# EAGLE design GPS_radiologger_v5_b (EAGLE 9.5.2)
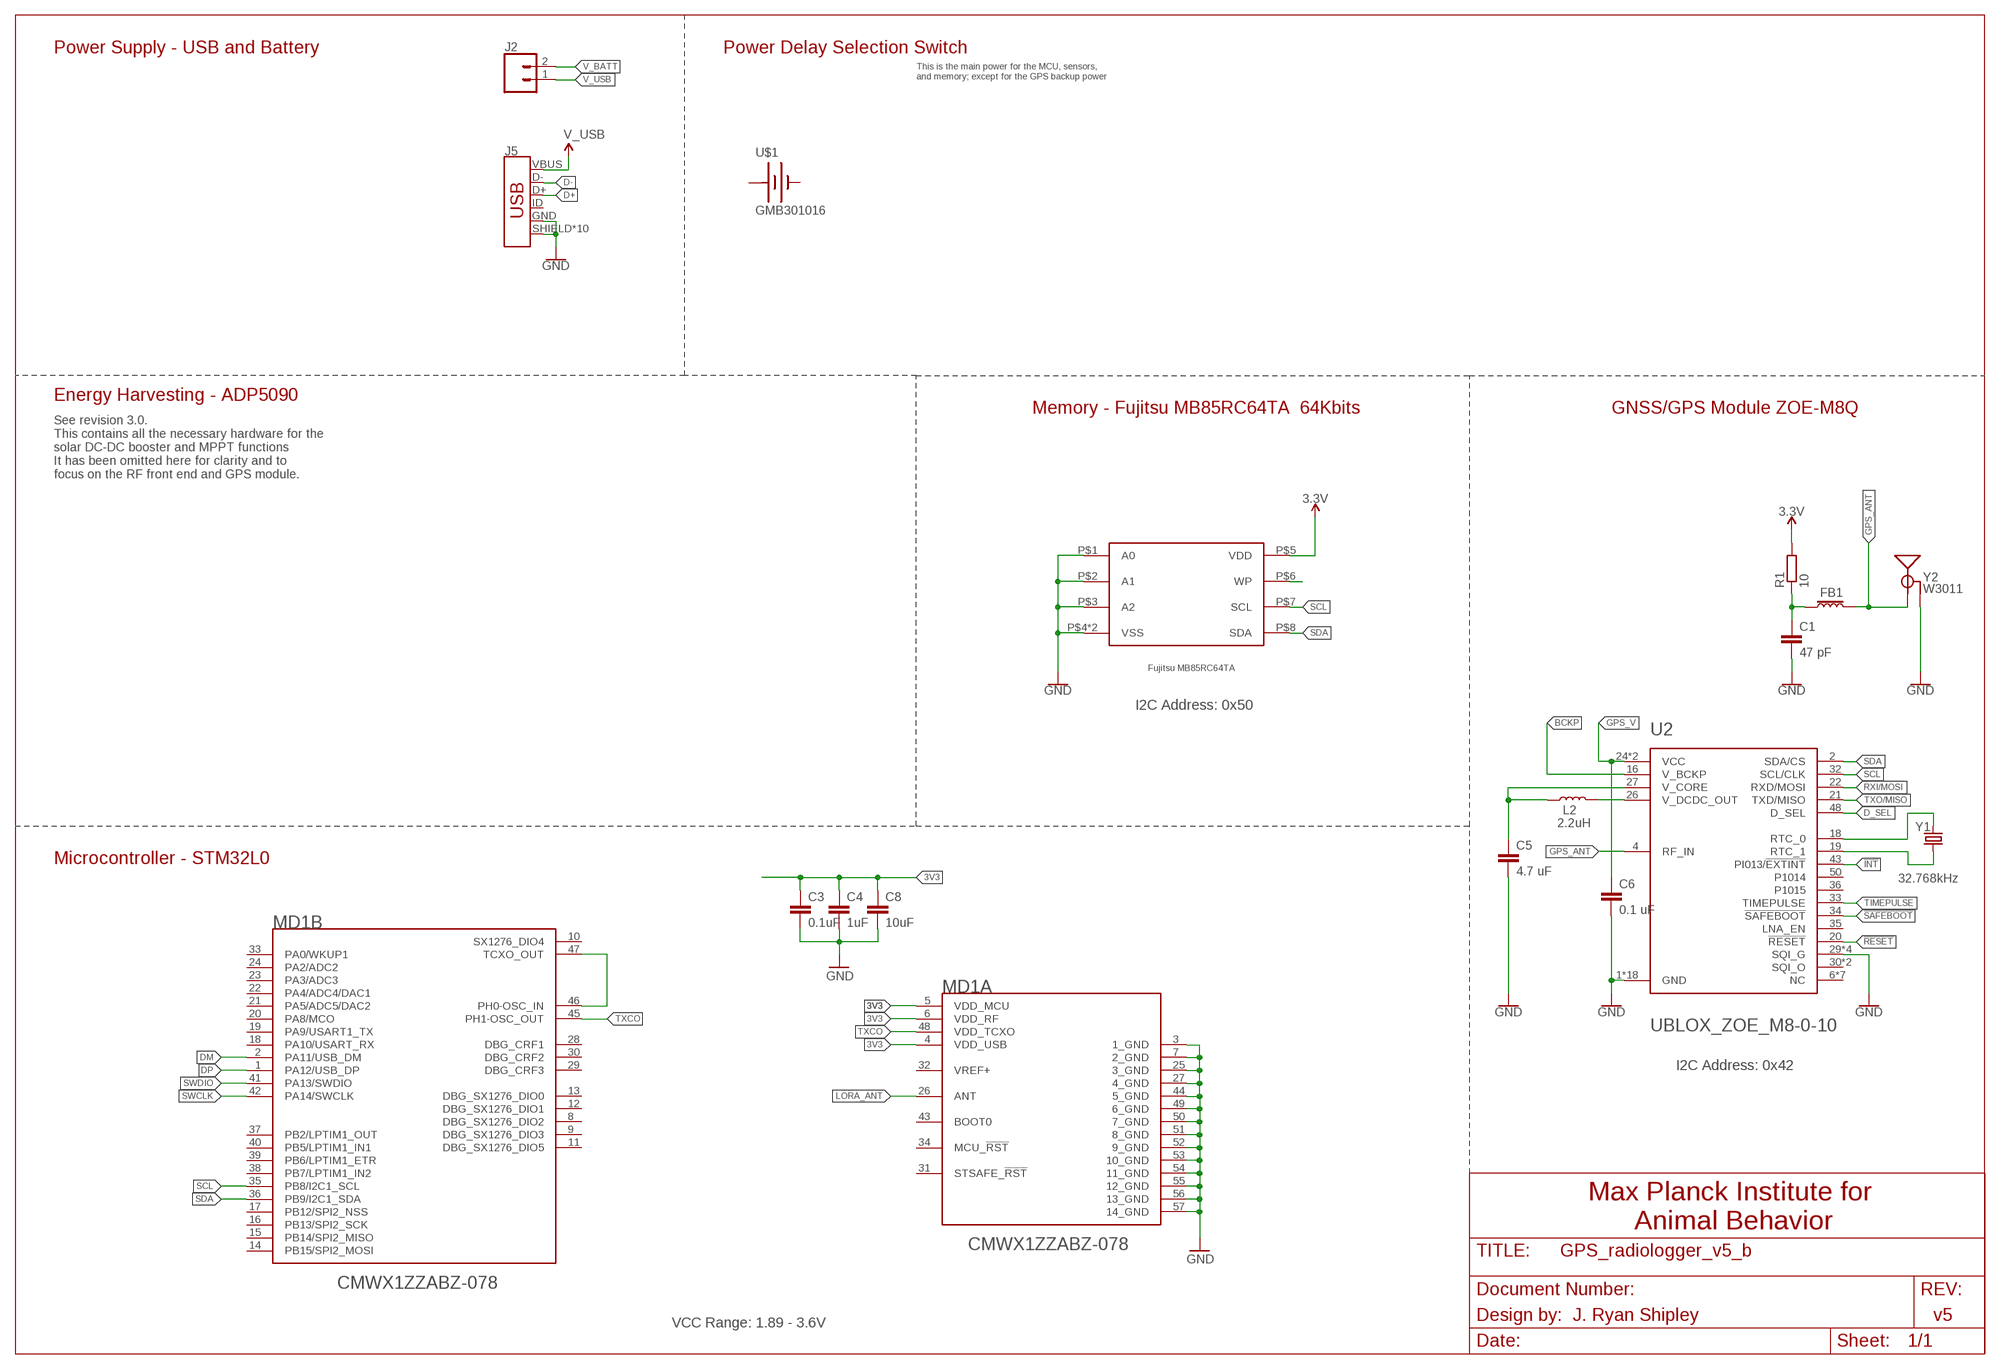
[diagram p0: schematic, sheet 1]

## Parts
C1  47 pF  C-EUC0201  [C0201]
C3  0.1uF  C-EUC0201  [C0201]
C4  1uF  C-EUC0201  [C0201]
C5  4.7 uF  C-EUC0201  [C0201]
C6  0.1 uF  C-EUC0201  [C0201]
C8  10uF  C-EUC0201  [C0201]
FB1  FERRITE_BEAD-120_OHM-0402  [0402]
J2  CONN_02  [1X02]
J5  USB_MICRO-B_HALF_PTH_MILL  [USB-MICROB-PTH-MILL]
L2  2.2uH  2.2μH_SHIELDED_INDUCTOR  [0806]
MD1  MURATA_CMWX1ZZABZ-078MURATA_CMWX1ZZABZ-078_0_0  [MURATA_CMWX1ZZABZ-078_0]
R1  10  R-EU_R0201  [R0201]
U2  UBLOX_ZOE_M8-0-10  [UBLOX_ZOE_M8-0-10]
U$1  GMB301016  [GMB301016]
U$2  MB85RC64TA  [8-SON_2X3]
Y1  32.768kHz  CRYSTAL-32.768KHZSMD-3.2X1.5  [CRYSTAL-SMD-3.2X1.5MM]
Y2  W3011  GPS_CHIP_ANTENNAW3011  [W3011]

## Nets
3.3V: R1.2 U$2.P$5(VDD)
3V3: C3.1 C4.1 C8.1 MD1.4(A:VDD_USB) MD1.5(A:VDD_MCU) MD1.6(A:VDD_RF)
!INT: U2.43(PI013/!EXTINT)
!RESET: U2.20(!RESET)
!SAFEBOOT: U2.34(!SAFEBOOT)
BCKP: U2.16(V_BCKP)
D+: J5.D+
D-: J5.D-
D_SEL: U2.48(D_SEL)
DM: MD1.2(B:PA11/USB_DM)
DP: MD1.1(B:PA12/USB_DP)
GND: C1.2 C3.2 C4.2 C5.2 C6.2 C8.2 J5.GND J5.SHIELD J5.SHIELD2(SHIELD) J5.SHIELD3(SHIELD) J5.SHIELD4(SHIELD) J5.SHIELD5(SHIELD) J5.SHIELD6(SHIELD) J5.SHIELD7(SHIELD) J5.SHIELD8(SHIELD) J5.SHIELD9(SHIELD) J5.SHIELD10(SHIELD) MD1.3(A:1_GND) MD1.7(A:2_GND) MD1.25(A:3_GND) MD1.27(A:4_GND) MD1.44(A:5_GND) MD1.49(A:6_GND) MD1.50(A:7_GND) MD1.51(A:8_GND) MD1.52(A:9_GND) MD1.53(A:10_GND) MD1.54(A:11_GND) MD1.55(A:12_GND) MD1.56(A:13_GND) MD1.57(A:14_GND) U2.1(GND) U2.3(GND) U2.5(GND) U2.7(GND) U2.8(GND) U2.9(GND) U2.10(GND) U2.11(GND) U2.12(GND) U2.17(GND) U2.23(GND) U2.29(SQI_G) U2.31(SQI_G) U2.37(GND) U2.38(GND) U2.39(GND) U2.40(GND) U2.41(GND) U2.44(GND) U2.46(SQI_G) U2.47(SQI_G) U2.49(GND) U$2.P$1(A0) U$2.P$2(A1) U$2.P$3(A2) U$2.P$4(VSS) U$2.P$9(VSS) Y2.2(GND) Y2.3(GND)
GPS_ANT: FB1.1 U2.4(RF_IN) Y2.1(SIGNAL)
GPS_V: C6.1 U2.24(VCC) U2.25(VCC)
LORA_ANT: MD1.26(A:ANT)
N$3: U$2.P$6(WP)
N$4: L2.2 U2.26(V_DCDC_OUT)
N$6: MD1.46(B:PH0-OSC_IN) MD1.47(B:TCXO_OUT)
N$9: C1.1 FB1.2 R1.1
N$13: C5.1 L2.1 U2.27(V_CORE)
N$14: U2.18(RTC_0) Y1.P$2
N$15: U2.19(RTC_1) Y1.P$1
RXI/MOSI: U2.22(RXD/MOSI)
SCL: MD1.35(B:PB8/I2C1_SCL) U2.32(SCL/CLK) U$2.P$7(SCL)
SDA: MD1.36(B:PB9/I2C1_SDA) U2.2(SDA/CS) U$2.P$8(SDA)
SWCLK: MD1.42(B:PA14/SWCLK)
SWDIO: MD1.41(B:PA13/SWDIO)
TIMEPULSE: U2.33(TIMEPULSE)
TXCO: MD1.45(B:PH1-OSC_OUT) MD1.48(A:VDD_TCXO)
TXO/MISO: U2.21(TXD/MISO)
V_BATT: J2.2
V_USB: J2.1 J5.VBUS
Unconnected: J5.ID MD1.8(B:DBG_SX1276_DIO2) MD1.9(B:DBG_SX1276_DIO3) MD1.10(B:SX1276_DIO4) MD1.11(B:DBG_SX1276_DIO5) MD1.12(B:DBG_SX1276_DIO1) MD1.13(B:DBG_SX1276_DIO0) MD1.14(B:PB15/SPI2_MOSI) MD1.15(B:PB14/SPI2_MISO) MD1.16(B:PB13/SPI2_SCK) MD1.17(B:PB12/SPI2_NSS) MD1.18(B:PA10/USART_RX) MD1.19(B:PA9/USART1_TX) MD1.20(B:PA8/MCO) MD1.21(B:PA5/ADC5/DAC2) MD1.22(B:PA4/ADC4/DAC1) MD1.23(B:PA3/ADC3) MD1.24(B:PA2/ADC2) MD1.28(B:DBG_CRF1) MD1.29(B:DBG_CRF3) MD1.30(B:DBG_CRF2) MD1.31(A:STSAFE_!RST!) MD1.33(B:PA0/WKUP1) MD1.34(A:MCU_!RST!) MD1.37(B:PB2/LPTIM1_OUT) MD1.38(B:PB7/LPTIM1_IN2) MD1.39(B:PB6/LPTIM1_ETR) MD1.40(B:PB5/LPTIM1_IN1) MD1.43(A:BOOT0) U2.6(NC) U2.13(NC) U2.14(NC) U2.15(NC) U2.28(NC) U2.30(SQI_O) U2.35(LNA_EN) U2.36(P1015) U2.42(NC) U2.45(SQI_O) U2.50(P1014) U2.51(NC)

## Notes on the sheet
- Power Supply - USB and Battery | Power Delay Selection Switch
- This is the main power for the MCU, sensors,
  and memory; except for the GPS backup power
- Energy Harvesting - ADP5090
- Memory - Fujitsu MB85RC64TA  64Kbits | GNSS/GPS Module ZOE-M8Q
- See revision 3.0.  
  This contains all the necessary hardware for the 
  solar DC-DC booster and MPPT functions
  It has been omitted here for clarity and to 
  focus on the RF front end and GPS module.
- I2C Address: 0x50
- Microcontroller - STM32L0
- I2C Address: 0x42
- Max Planck Institute for 
  Animal Behavior
- Design by: | J. Ryan Shipley | v5
- VCC Range: 1.89 - 3.6V

## Power pins joined to a net without a drawn wire
+: U$1.+
-: U$1.-
VREF+: MD1.32(A:VREF+)

## Library data of the parts
C1 C3-C6 C8 = rcl:C-EU: CAPACITOR, European symbol; SPICEPREFIX: C
FB1 = SparkFun-Coils:FERRITE_BEAD-120_OHM: Ferrite Bead (blocks, cores, rings, chokes, etc.) Inductor with layers of ferrite used to suppress high frequencies. Often used to isolate high frequency noise.; MFG_PART: BLM15HB121SN1D; PROD_ID: NDUC-14206
J2 = SparkFun-Connectors:CONN_02: Multi connection point. Often used as Generic Header-pin footprint for 0.1 inch spaced/style header connections On any of the 0.1 inch spaced packages, you can populate with these: Break Away Headers - Straight <https://www.sparkfun.com/products/116> (PRT-00116) Break Away Male Headers - Right Angle <https://www.sparkfun.com/products/553> (PRT-00553) Female Headers <https://www.sparkfun.com/products/115> (PRT-00115) Break Away Headers - Machine Pin <https://www.sparkfun.com/products/117> (PRT-00117) Break Away Female Headers - Swiss Machine Pin <https://www.sparkfun.com/products/743> (PRT-00743) For SCREWTERMINALS and SPRING TERMINALS visit here: Screw Terimnals on SparkFun.com <https://www.sparkfun.com/search/results?term=Screw+Terminals> (5mm/3.5mm/2.54mm spacing) This device is also useful as a general connection point to wire up your design to another part of your project. Our various solder wires solder well into these plated through hole pads. Hook-Up Wire - Assortment (Stranded, 22 AWG) <https://www.sparkfun.com/products/11375> (PRT-11375) Hook-Up Wire - Assortment (Solid Core, 22 AWG) <https://www.sparkfun.com/products/11367> (PRT-11367) View the entire wire category on our website here <https://www.sparkfun.com/categories/141> Special notes: Molex polarized connector foot print use with: PRT-08233 with associated crimp pins and housings. 2.54_SCREWTERM for use with PRT-10571. 3.5mm Screw Terminal footprints for PRT-08084 5mm Screw Terminal footprints for use with PRT-08432
J5 = SparkFun-Connectors:USB_MICRO-B: USB Type Micro-B Connector Male/female and PTH/SMT variants SparkFun Products: SparkFun microB USB Breakout <https://www.sparkfun.com/products/12035> SparkFun USB microB Plug Breakout <https://www.sparkfun.com/products/10031> SparkFun ESP8266 Thing <https://www.sparkfun.com/products/13231>; PROD_ID: CONN-13711
L2 = SparkFun-Coils:2.2μH_SHIELDED_INDUCTOR: Murata 2.2uH Inductor 2.2uH 1.2A 110mOhm 0806 Package Shielded; PROD_ID: NDUC-14257
MD1 = Murata - CMWX1ZZABZ-078:MURATA_CMWX1ZZABZ-078: General ISM < 1GHz LoRa™ Transceiver Module 868MHz, 915MHz Surface Mount; AUTOMOTIVE: No; BANDWIDTH: 47MHz; CENTROID_NOT_SPECIFIED: No; DATASHEET: https://d3s5r33r268y59.cloudfront.net/datasheets/9465/2017-04-18-03-35-57/typeABZ_datasheet.pdf; DEVICE_CLASS_L1: Integrated Circuits (ICs); DEVICE_CLASS_L2: RF Semiconductors and Devices; DEVICE_CLASS_L3: Transceivers; DIGIKEY_DESCRIPTION: UNK LORA MODULE; DIGIKEY_PART_NUMBER: 490-16143-1-ND; FOOTPRINT_VARIANT_NAME_0: Recommended_Land_Pattern; HEIGHT: 1.76mm; INTERFACE: I2C,SPI,UART,USB; LEAD_FREE: Yes; MAX_FREQUENCY: 915MHz; MAX_SUPPLY_VOLTAGE: 3.6V; MF: Murata; MFG_PACKAGE_IDENT: CMWX1ZZABZ-078; MFG_PACKAGE_IDENT_DATE: 0; MFG_PACKAGE_IDENT_REV: 0; MIN_SUPPLY_VOLTAGE: 1.8V; MOUSER_PART_NUMBER: 81-CMWX1ZZABZ-078; MPN: CMWX1ZZABZ-078; PACKAGE: SMD_MODULE_12MM5_11MM6; PREFIX: MD; RECEIVING_CURRENT: 21.5-23.6mA; ROHS: Yes; SENSITIVITY: -133dBm; TEMPERATURE_RANGE_HIGH: +85°C; TEMPERATURE_RANGE_LOW: -40°C; TRANSMITTING_CURRENT: 36-128mA; VERIFICATION_VERSION: 0.0.0.3
R1 = rcl:R-EU_: RESISTOR, European symbol; SPICEPREFIX: R
U2 = SparkFun-GPS:UBLOX_ZOE_M8-0-10: UBLOX ZOE-M8Q-0-10 u-blox ZOE-M8 standard precision GNSS SiP (System in Package) modules feature the high performance u-blox M8 GNSS engine. ZOE-M8’s ultra-miniature form factor integrates a complete GNSS receiver including SAW filter, LNA and TCXO. Handles all GNSS systems and can simulatenously use up to three of them, with accuracy ranging from 2.5m to 4m. GPS GLONASS BeiDou Galileo This can be corrected with the SBAS or QZSS augmentation systems.; PROD_ID: IC-14251
U$1 = Powerstream:GMB301016
U$2 = Fujitsu_FRAM:MB85RC64TA
Y1 = SparkFun-Clocks:CRYSTAL-32.768KHZ: 32.768kHz Crystal Frequency: 32.768kHz Frequency Stability: ±20ppm Load Capacitance: 12.5pF (PTH-2X6 & SMD-3.2X1.5), 6pF (SMD-2X6) SparkFun Products: SparkFun BigTime Watch Kit <https://www.sparkfun.com/products/11734> SparkFun nRF52832 Breakout <https://www.sparkfun.com/products/13990> SparkFun Real Time Clock Module <https://www.sparkfun.com/products/12708>; PROD_ID: XTAL-13062
Y2 = SparkFun-GPS:GPS_CHIP_ANTENNA; PROD_ID: ANT-14304

## Net classes
1 vcc: width 0 mm

## Board
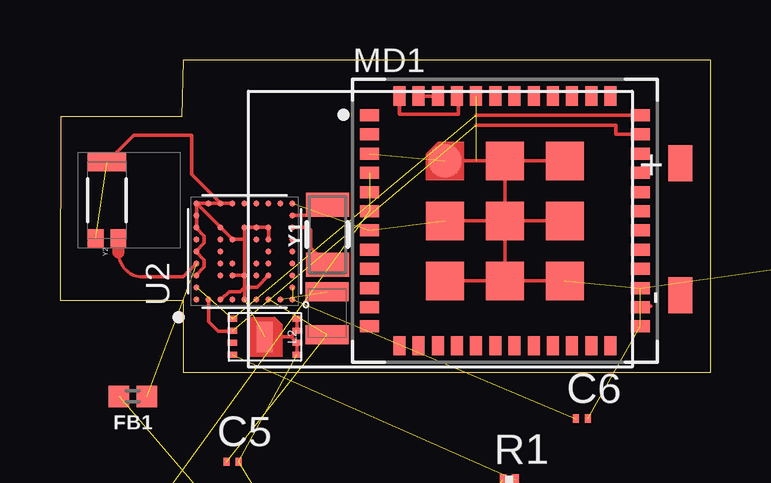
[diagram p1: board, top side]
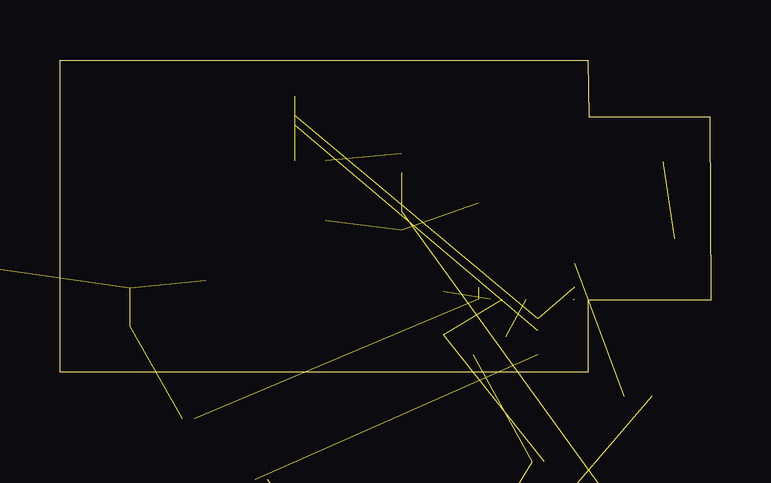
[diagram p2: board, bottom side, seen from below]

Size 27.13 x 13 mm. Coordinates in mm from the lower left corner, seen from the top.
Outline: 5.13,0 27.13,0 27.13,13 5.13,13 5.08,10.64 0.04,10.64 0,3 5.13,3 5.13,0
Copper layers (1*16): Top 0.035mm / dielectric 1.5mm / Bottom 0.035mm
Design rules "default *": minimum track width 4mil, minimum drill 0.35mm, track to track 5mil, track to pad 5mil, pad to pad 5mil, via to via 5mil, smd to smd 5mil, copper to edge 20mil, drill to drill 3mil, minimum pad ring 10mil, minimum via ring 8mil, stop-mask expansion 4mil, vias tented up to drill 0mil, thermal gap 10mil

### Footprints (pad centres in the part's own frame; a part is rotated, then mirrored left to right if it is on the bottom)
C0201 = smd 0.25 x 0.35: 1 -0.25,0; 2 0.25,0
0402 = smd 0.85 x 0.9: 1 -0.58,0; 2 0.58,0
1X02 = drill 1.016 pad 1.88: 1 0,0; 2 2.54,0
USB-MICROB-PTH-MILL = smd 0.4 x 1.75: D+ 0,0; D- -0.65,0; GND 1.3,0; ID 0.65,0; VBUS -1.3,0 | smd 2 x 1.46: SHIELD -2.9,0.275; SHIELD2 2.9,0.275 | smd 1.425 x 2.5: SHIELD3 -0.963,-2.675; SHIELD4 0.963,-2.675 | smd 1.4 x 2.1 bottom: SHIELD5 -2.731,-2.531; SHIELD7 2.729,-2.531 | smd 1 x 1: SHIELD6 2.7,-2.575 | smd 1.1 x 1.5: SHIELD8 -2.731,-2.731 | smd 1 x 1.3 bottom: SHIELD9 -2.43,0.195; SHIELD10 2.43,0.195
0806 = smd 0.8 x 1.8: 1 -0.9,0; 2 0.9,0
MURATA_CMWX1ZZABZ-078_0 = smd 0.8 x 0.5: 1 -5.65,4.4; 2 -5.65,3.6; 3 -5.65,2.8; 4 -5.65,2; 5 -5.65,1.2; 6 -5.65,0.4; 7 -5.65,-0.4; 8 -5.65,-1.2; 9 -5.65,-2; 10 -5.65,-2.8; 11 -5.65,-3.6; 12 -5.65,-4.4; 25 5.65,-4.4; 26 5.65,-3.6; 27 5.65,-2.8; 28 5.65,-2; 29 5.65,-1.2; 30 5.65,-0.4; 31 5.65,0.4; 32 5.65,1.2; 33 5.65,2; 34 5.65,2.8; 35 5.65,3.6; 36 5.65,4.4 | smd 0.5 x 0.8: 13 -4.4,-5.2; 14 -3.6,-5.2; 15 -2.8,-5.2; 16 -2,-5.2; 17 -1.2,-5.2; 18 -0.4,-5.2; 19 0.4,-5.2; 20 1.2,-5.2; 21 2,-5.2; 22 2.8,-5.2; 23 3.6,-5.2; 24 4.4,-5.2; 37 4.4,5.2; 38 3.6,5.2; 39 2.8,5.2; 40 2,5.2; 41 1.2,5.2; 42 0.4,5.2; 43 -0.4,5.2; 44 -1.2,5.2; 45 -2,5.2; 46 -2.8,5.2; 47 -3.6,5.2; 48 -4.4,5.2 | smd 1.4 x 1.4: 49 -2.5,2.5 | smd 1.6 x 1.6: 50 0,2.5; 51 2.5,2.5; 52 -2.5,0; 53 0,0; 54 2.5,0; 55 -2.5,-2.5; 56 0,-2.5; 57 2.5,-2.5
R0201 = smd 0.28 x 0.43: 1 -0.255,0; 2 0.255,0
UBLOX_ZOE_M8-0-10 = smd 0.25 x 0.25: 1 -1.996,2.004; 2 -1.496,2.004; 3 -0.996,2.004; 4 -0.496,2.004; 5 0.004,2.004; 6 0.504,2.004; 7 1.004,2.004; 8 1.504,2.004; 9 2.004,2.004; 10 2.004,1.504; 11 2.004,1.004; 12 2.004,0.504; 13 2.004,0.004; 14 2.004,-0.496; 15 2.004,-0.996; 16 2.004,-1.496; 17 2.004,-1.996; 18 1.504,-1.996; 19 1.004,-1.996; 20 0.504,-1.996; 21 0.004,-1.996; 22 -0.496,-1.996; 23 -0.996,-1.996; 24 -1.496,-1.996; 25 -1.996,-1.996; 26 -1.996,-1.496; 27 -1.996,-0.996; 28 -1.996,-0.496; 29 -1.996,0.004; 30 -1.996,0.504; 31 -1.996,1.004; 32 -1.996,1.504; 33 -0.996,1.004; 34 -0.496,1.004; 35 0.004,1.004; 36 0.504,1.004; 37 1.004,1.004; 38 1.004,0.004; 39 1.004,-0.496; 40 1.004,-0.996; 41 0.504,-0.996; 42 0.004,-0.996; 43 -0.496,-0.996; 44 -0.996,-0.996; 45 -0.996,-0.496; 46 -0.996,0.004; 47 -0.996,0.504; 48 -0.496,0.504; 49 0.504,0.504; 50 0.504,-0.496; 51 -0.496,-0.496
GMB301016 = smd 1.5 x 1: + -2.75,10; - 2.75,10
8-SON_2X3 = smd 0.25 x 0.4: P$1 0.75,-1.35; P$2 0.25,-1.35; P$3 -0.25,-1.35; P$4 -0.75,-1.35; P$5 -0.75,1.35; P$6 -0.25,1.35; P$7 0.25,1.35; P$8 0.75,1.35 | smd 1.27 x 0.635: P$9 0,0
CRYSTAL-SMD-3.2X1.5MM = smd 1 x 1.8: P$1 -1.25,0; P$2 1.25,0
W3011 = smd 0.8 x 0.65: 1 1.6,0.475; 2 1.6,-0.475 | smd 0.8 x 1.6: 3 -1.6,0

### Placement (x,y rotation side)
C1  12.49,-12.43 0 top  (outside the outline)
C3  -5.76,-19.43 0 top  (outside the outline)
C4  -5.76,-22.91 0 top  (outside the outline)
C5  7.19,-3.74 0 top  (outside the outline)
C6  21.76,-1.94 0 top
C8  -5.76,-26.39 0 top  (outside the outline)
FB1  3.04,-1.02 180 top
J2  39.94,2.18 0 top  (outside the outline)
J5  43.16,8.52 270 top  (outside the outline)
L2  11.14,2.45 90 top
MD1  18.55,6.3 0 top
R1  18.73,-4.48 0 top  (outside the outline)
U2  7.7,5.02 90 top
U$1  15.86,5.95 270 top
U$2  8.54,1.46 90 top
Y1  11.15,5.72 90 top
Y2  1.97,7.16 270 top

### Tracks (layer width: path | path; a pad name or v marks a point on that pad's centre or on a via)
3.3V  (1 unrouted)
3V3  (5 unrouted)
GND  (26 unrouted)
  Top 0.152: 7.69,5.57 U2.38 U2.39 U2.40 U2.41 | 7.69,5.57 U2.46 | U2.46 U2.47 | 7.69,5.57 7.64,5.52 U2.49 U2.37 U2.9 | U2.46 7.69,3.54 | 7.69,3.54 U2.29 | 7.69,3.54 8.21,3.54 U2.44 | 7.69,3.54 7.5,3.35 7.06,3.35 6.73,3.02 U2.31 6.66,3.02 | U2.9 U2.10 U2.12 | U2.9 U2.8 U2.7 5.69,5.99 6.02,5.66 6.02,5.39 5.69,5.06 U2.5 5.69,4.99 6.02,4.66 6.02,4.39 5.69,4.06 U2.3 | 5.73,3.02 5.71,3.02 | U2.11 5.48,8.23 5.48,9.87 3.08,9.87 Y2.3 | MD1.55 MD1.56 | MD1.56 MD1.57 | MD1.54 MD1.53 | MD1.53 MD1.52 | MD1.49 MD1.50 | MD1.50 MD1.51 | MD1.50 MD1.53 | MD1.53 MD1.56 | 9.64,1.46 U$2.P$2 U$2.P$1 | 9.64,1.46 U$2.P$9 | 9.64,1.46 U$2.P$3 U$2.P$4 | 17.35,8.8 MD1.50
GPS_ANT  (1 unrouted)
  Top 0.127: 2.44,4.97 arc90 3.44,3.97
  Top 0.152: 3.44,3.97 5.14,3.97 U2.4
  Top 0.508: 2.44,4.97 Y2.1
GPS_V  (2 unrouted)
LORA_ANT
  Top 0.152: MD1.26 24.27,2.77 24.6,2.77 24.63,2.74
N$4  (1 unrouted)
N$6
  Top 0.152: MD1.46 MD1.47
N$9  (2 unrouted)
N$13  (2 unrouted)
N$14
  Top 0.152: Y1.P$2 10.7,6.52 U2.18
N$15
  Top 0.152: Y1.P$1 10.44,5.18 10.44,5.92 10.34,6.02 U2.19
SCL  (1 unrouted)
  Top 0.152: U2.32 6.19,2.1 6.59,1.7 U$2.P$7 | MD1.35 23.18,9.9 23.18,10.27 17.34,10.27
SDA  (2 unrouted)
  Top 0.152: MD1.36 17.35,10.7 17.35,10.69
TXCO
  Top 0.152: MD1.48 14.15,10.73 16.61,10.73 16.61,11.5 MD1.45
V_USB  (1 unrouted)